# Altium schematic sheet Audio Codec TI WIP.SchDoc: Audio Codec
size Tabloid; ApprovedBy: NA; CompanyName: Cospan Design LLC; DrawnBy: David McCoy; Engineer: David McCoy; DocumentNumber: 13; Revision: A; SheetNumber: 13; SheetTotal: 18; Client: OSH; Project: Guppy Buddy; ProjectPrettyName: Guppy Buddy
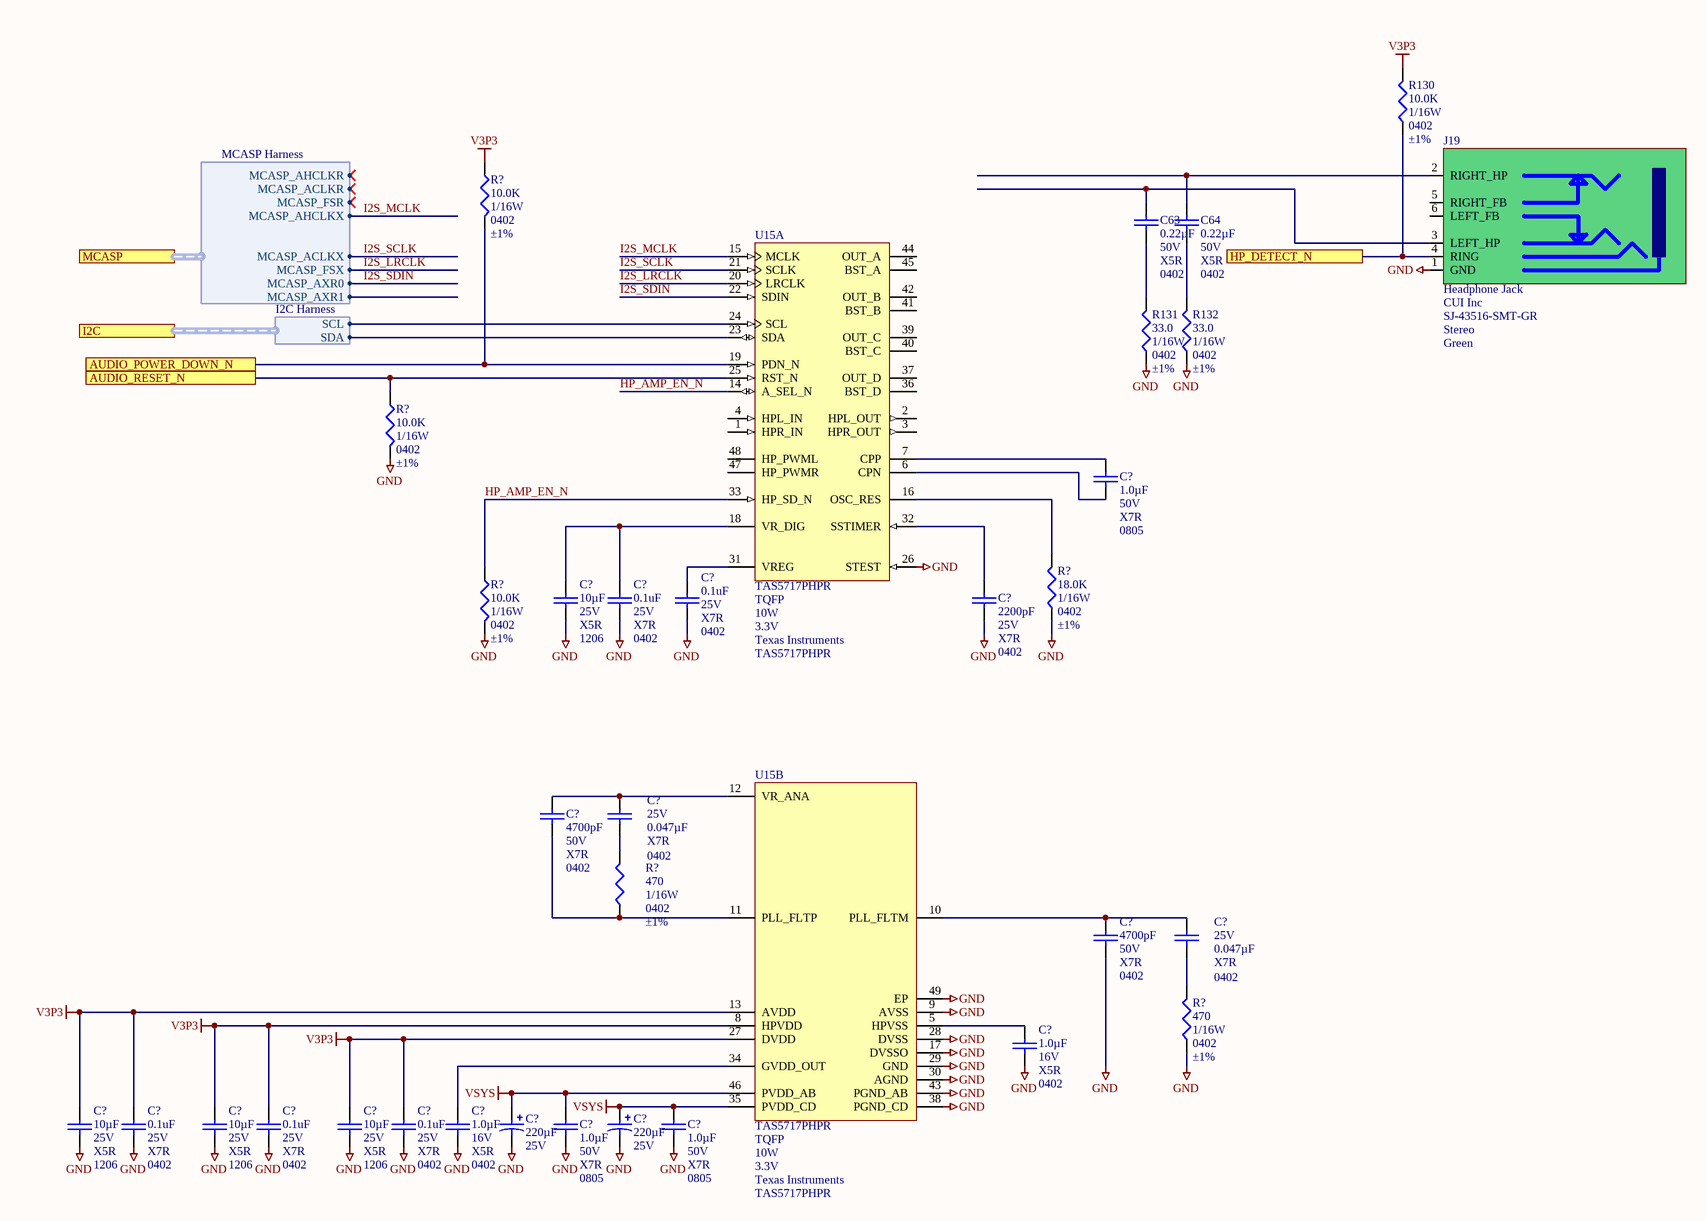
[diagram p0: Audio Codec TI WIP.SchDoc]

## Parts
(Parts that share a designator on the sheet are numbered #1, #2 ... from top to bottom, then left to right.)
C63  Capacitance: 0.22µF  Voltage - Rated: 50V  Temperature Coefficient: X5R  Package / Case: 0402  [C_ERA-0402]  (hidden comment: C_0402_0.22UF_50V)
C64  Capacitance: 0.22µF  Voltage - Rated: 50V  Temperature Coefficient: X5R  Package / Case: 0402  [C_ERA-0402]  (hidden comment: C_0402_0.22UF_50V)
C?#1  Capacitance: 1.0µF  Voltage - Rated: 50V  Temperature Coefficient: X7R  Package / Case: 0805  [C_ERA-0805]  (hidden comment: 1.0uF)
C?#2  Capacitance: 0.1uF  Voltage - Rated: 25V  Temperature Coefficient: X7R  Package / Case: 0402  [C_0402]  (hidden comment: C_0402_0.1UF_25V)
C?#3  Capacitance: 0.1uF  Voltage - Rated: 25V  Temperature Coefficient: X7R  Package / Case: 0402  [C_0402]  (hidden comment: C_0402_0.1UF_25V)
C?#4  Capacitance: 2200pF  Voltage - Rated: 25V  Temperature Coefficient: X7R  Package / Case: 0402  [C_ERA-0402]  (hidden comment: C_0402_2.2NF)
C?#5  Voltage - Rated: 25V  Temperature Coefficient: X5R  Package / Case: 1206  [CAP-1206]  (hidden comment: 10µF)
C?#6  Voltage - Rated: 50V  Temperature Coefficient: X7R  Package / Case: 0402  [C_ERA-0402]  (hidden comment: 4700pF)
C?#7  Voltage - Rated: 25V  Capacitance: 0.047µF  Temperature Coefficient: X7R  Package / Case: 0402  [C_ERA-0402]  (hidden comment: 0.047UF)
C?#8  Voltage - Rated: 50V  Temperature Coefficient: X7R  Package / Case: 0402  [C_ERA-0402]  (hidden comment: 4700pF)
C?#9  Voltage - Rated: 25V  Capacitance: 0.047µF  Temperature Coefficient: X7R  Package / Case: 0402  [C_ERA-0402]  (hidden comment: 0.047UF)
C?#10  Capacitance: 1.0µF  Voltage - Rated: 16V  Temperature Coefficient: X5R  Package / Case: 0402  [C_0402]  (hidden comment: 1.0uF)
C?#11  Capacitance: 0.1uF  Voltage - Rated: 25V  Temperature Coefficient: X7R  Package / Case: 0402  [C_0402]  (hidden comment: C_0402_0.1UF_25V)
C?#12  Capacitance: 0.1uF  Voltage - Rated: 25V  Temperature Coefficient: X7R  Package / Case: 0402  [C_0402]  (hidden comment: C_0402_0.1UF_25V)
C?#13  Capacitance: 0.1uF  Voltage - Rated: 25V  Temperature Coefficient: X7R  Package / Case: 0402  [C_0402]  (hidden comment: C_0402_0.1UF_25V)
C?#14  Voltage - Rated: 25V  [CAP_INDP190170X170L]  (hidden comment: 220µF)
C?#15  Voltage - Rated: 25V  [CAP_INDP190170X170L]  (hidden comment: 220µF)
C?#16  Capacitance: 1.0µF  Voltage - Rated: 16V  Temperature Coefficient: X5R  Package / Case: 0402  [C_0402]  (hidden comment: 1.0uF)
C?#17  Voltage - Rated: 25V  Temperature Coefficient: X5R  Package / Case: 1206  [CAP-1206]  (hidden comment: 10µF)
C?#18  Voltage - Rated: 25V  Temperature Coefficient: X5R  Package / Case: 1206  [CAP-1206]  (hidden comment: 10µF)
C?#19  Voltage - Rated: 25V  Temperature Coefficient: X5R  Package / Case: 1206  [CAP-1206]  (hidden comment: 10µF)
C?#20  Capacitance: 1.0µF  Voltage - Rated: 50V  Temperature Coefficient: X7R  Package / Case: 0805  [C_ERA-0805]  (hidden comment: 1.0uF)
C?#21  Capacitance: 1.0µF  Voltage - Rated: 50V  Temperature Coefficient: X7R  Package / Case: 0805  [C_ERA-0805]  (hidden comment: 1.0uF)
J19  Headphone Jack  Manufacturer: CUI Inc  Manufacturer Part Number: SJ-43516-SMT-GR  Signal Lines: Stereo  Color: Green  [HEADPHONE_JACK]
R130  Resistance In Ohms: 10.0K  Power (Watts): 1/16W  Case: 0402  Tolerance: ±1%  [R_0402]  (hidden comment: R_0402_10.0K)
R131  Resistance In Ohms: 33.0  Power (Watts): 1/16W  Case: 0402  Tolerance: ±1%  [R_0402]  (hidden comment: R_0402_33)
R132  Resistance In Ohms: 33.0  Power (Watts): 1/16W  Case: 0402  Tolerance: ±1%  [R_0402]  (hidden comment: R_0402_33)
R?#1  Resistance In Ohms: 10.0K  Power (Watts): 1/16W  Case: 0402  Tolerance: ±1%  [R_0402]  (hidden comment: R_0402_10.0K)
R?#2  Resistance In Ohms: 10.0K  Power (Watts): 1/16W  Case: 0402  Tolerance: ±1%  [R_0402]  (hidden comment: R_0402_10.0K)
R?#3  Resistance In Ohms: 18.0K  Power (Watts): 1/16W  Case: 0402  Tolerance: ±1%  [R_0402]  (hidden comment: 18.0k Ohms)
R?#4  Resistance In Ohms: 10.0K  Power (Watts): 1/16W  Case: 0402  Tolerance: ±1%  [R_0402]  (hidden comment: R_0402_10.0K)
R?#5  Power (Watts): 1/16W  Case: 0402  Tolerance: ±1%  [R_0402]  (hidden comment: 470)
R?#6  Power (Watts): 1/16W  Case: 0402  Tolerance: ±1%  [R_0402]  (hidden comment: 470)
U15  TAS5717PHPR  Case/Package: TQFP  Output Power: 10W  Operating Supply Voltage: 3.3V  Manufacturer 1: Texas Instruments  [TI-PHP48-4550X3600TP_L]  (parts A,B of 2)

## Ports
AUDIO_POWER_DOWN_N, AUDIO_RESET_N, HP_DETECT_N, I2C (harness I2C Harness), MCASP (harness MCASP Harness)

## Harnesses
I2C Harness: SCL, SDA
MCASP Harness: MCASP_ACLKX, MCASP_FSX, MCASP_AXR0, MCASP_AHCLKR, MCASP_ACLKR, MCASP_FSR, MCASP_AXR1, MCASP_AHCLKX

## Nets
GND: C?#2.1 C?#3.1 C?#4.1 C?#5.1 C?#8.1 C?#10.1 C?#11.1 C?#12.1 C?#13.1 C?#14.2 C?#15.2 C?#16.1 C?#17.1 C?#18.1 C?#19.1 C?#20.1 C?#21.1 J19.1(GND) R131.2 R132.2 R?#2.2 R?#3.2 R?#4.2 R?#6.2 U15.9(AVSS) U15.17(DVSSO) U15.26(STEST) U15.28(DVSS) U15.29(GND) U15.30(AGND) U15.38(PGND_CD) U15.43(PGND_AB) U15.49(EP)
V3P3: C?#11.2 C?#12.2 C?#13.2 C?#17.2 C?#18.2 C?#19.2 R130.1 R?#1.1 U15.8(HPVDD) U15.13(AVDD) U15.27(DVDD)
VSYS: C?#14.1 C?#15.1 C?#20.2 C?#21.2 U15.35(PVDD_CD) U15.46(PVDD_AB)
AUDIO_POWER_DOWN_N: R?#1.2 U15.19(PDN_N) ; port AUDIO_POWER_DOWN_N
AUDIO_RESET_N: R?#2.1 U15.25(RST_N) ; port AUDIO_RESET_N
HP_AMP_EN_N: R?#4.1 U15.14(A_SEL_N) U15.33(HP_SD_N)
HP_DETECT_N: J19.4(RING) R130.2 ; port HP_DETECT_N
I2S_LRCLK: U15.20(LRCLK) ; port MCASP.MCASP_FSX
I2S_MCLK: U15.15(MCLK) ; port MCASP.MCASP_AHCLKX
I2S_SCLK: U15.21(SCLK) ; port MCASP.MCASP_ACLKX
I2S_SDIN: U15.22(SDIN) ; port MCASP.MCASP_AXR0
NetC63_1: C63.1 R131.1
NetC63_2: C63.2 J19.3(LEFT_HP)
NetC64_1: C64.1 R132.1
NetC64_2: C64.2 J19.2(RIGHT_HP)
NetC?#1_1: C?#1.1 U15.6(CPN)
NetC?#1_2: C?#1.2 U15.7(CPP)
NetC?#2_2: C?#2.2 C?#5.2 U15.18(VR_DIG)
NetC?#3_2: C?#3.2 U15.31(VREG)
NetC?#4_2: C?#4.2 U15.32(SSTIMER)
NetC?#6_1: C?#6.1 R?#5.2 U15.11(PLL_FLTP)
NetC?#6_2: C?#6.2 C?#7.2 U15.12(VR_ANA)
NetC?#7_1: C?#7.1 R?#5.1
NetC?#8_2: C?#8.2 C?#9.2 U15.10(PLL_FLTM)
NetC?#9_1: C?#9.1 R?#6.1
NetC?#10_2: C?#10.2 U15.5(HPVSS)
NetC?#16_2: C?#16.2 U15.34(GVDD_OUT)
NetR?#3_1: R?#3.1 U15.16(OSC_RES)
NetU15_23: U15.23(SDA) ; port I2C.SDA
NetU15_24: U15.24(SCL) ; port I2C.SCL

Not connected (* = marked no-connect by the designer): J19 5(RIGHT_FB) 6(LEFT_FB); U15 1(HPR_IN) 2(HPL_OUT) 3(HPR_OUT) 4(HPL_IN) 36(BST_D) 37(OUT_D) 39(OUT_C) 40(BST_C) 41(BST_B) 42(OUT_B) 44(OUT_A) 45(BST_A) 47(HP_PWMR) 48(HP_PWML)

## Notes on the sheet
- Project:
- http://www.cospandesign.com
- Cospan Design
- Document:
- Engineer:
- Title:
- Client:
- Approved By:
- Revision:
- Date:
- Number:
- of

## Library data of the parts
C63 C64 = C_0402_0.22UF_50V: CAP CER 0.22UF 50V X5R 0402; Manufacturer: Taiyo Yuden; Manufacturer Part Number: UMK105BJ224KV-F; Tolerance: ±10%; Supplier 1: Digi-Key; RoHS: RoHS Compliant; Category: Capacitors; Stock 1: 141424; Pricing 1: 1=0.35, 10=0.263, 50=0.1532, 100=0.1225, 250=0.08752, 500=0.0595, 1000=0.04813, 5000=0.03763 (USD); Packaging: Digi-Reel®; Mounting Type: Surface Mount, MLCC; Operating Temperature: -55°C ~ 85°C; Applications: General Purpose; Ratings: -; Size / Dimension: 0.039" L x 0.020" W (1.00mm x 0.50mm); Height - Seated (Max): -; Thickness (Max): 0.022" (0.55mm); Lead Spacing: -; Features: -; Lead Style: -; ComponentLink1URL: http://ds.yuden.co.jp/TYCOMPAS/ut/detail.do?productNo=UMK105BJ224KV-F&fileName=UMK105BJ224KV-F_SS&mode=specSheetDownload; ComponentLink1Description: http://ds.yuden.co.jp/TYCOMPAS/ut/detail.do?productNo=UMK105BJ224KV-F&fileName=UMK105BJ224KV-F_SS&mode=specSheetDownload; Supplier Part Number 1: 587-3500-6-ND
C?#1 C?#20 C?#21 = C_0805_1.0uF_50V: CAP CER 1UF 50V X7R 0805; Manufacturer 1: Samsung; Manufacturer Part Number 1: CL21B105KBFNNNG; Description 1: Cap Ceramic 1uF 50V X7R 10% SMD 0805 125C Embossed T/R; Material: Ceramic; Tolerance: 10%; ComponentLink1URL: http://search.murata.co.jp/Ceramy/image/img/PDF/ENG/GRM21BR71H105KA12.pdf; ComponentLink1Description: http://search.murata.co.jp/Ceramy/image/img/PDF/ENG/GRM21BR71H105KA12.pdf; Supplier 1: Digi-Key; Supplier Part Number 1: 1276-6470-6-ND; Stock 1: 0; Pricing 1: 1=0.13, 10=0.097, 100=0.043, 500=0.03072, 1000=0.02413 (USD); Mount: Surface Mount; Case/Package: 0805; Case Code (Metric): 2012; Case Code (Imperial): 0805; Contact Plating: Nickel,Tin; Min Operating Temperature: -55°C; Max Operating Temperature: 125°C; Packaging: Tape and Reel; Voltage Rating: 50V; Package Quantity: 3000; Dielectric: X7R; Termination: Wraparound; Voltage: 50V; Length: 2mm; Width: 0.049inch; Thickness: 0.053inch; Depth: 1.25mm; ComponentLink2URL: https://datasheet.ciiva.com/16428/cl05b104kq5nnnc-16428872.pdf; ComponentLink2Description: https://datasheet.ciiva.com/16428/cl05b104kq5nnnc-16428872.pdf; ComponentLink3URL: https://datasheet.ciiva.com/26310/mlcc-catalogdownload2013-eng-26310125.pdf; ComponentLink3Description: https://datasheet.ciiva.com/26310/mlcc-catalogdownload2013-eng-26310125.pdf; ComponentLink4URL: https://datasheet.ciiva.com/25733/cl21b105kbfnnng-25733278.pdf; ComponentLink4Description: https://datasheet.ciiva.com/25733/cl21b105kbfnnng-25733278.pdf; ComponentLink5URL: https://datasheet.ciiva.com/29199/455898-da-01-en-vs-kondensator-0805-29199201.pdf; ComponentLink5Description: https://datasheet.ciiva.com/29199/455898-da-01-en-vs-kondensator-0805-29199201.pdf
C?#2 C?#3 C?#11-C?#13 = C_0402_0.1UF_25V: CAP CER 0.1UF 25V X6S 0402; Manufacturer 1: Yageo; Manufacturer Part Number 1: CC0402KRX7R8BB104; Description 1: Cap Ceramic 0.1uF 25V X7R 10% SMD 0402 125C Paper T/R; Tolerance: 10%; Dissipation Factor: 3.5%; ComponentLink1URL: https://product.tdk.com/info/en/catalog/datasheets/mlcc_commercial_general_en.pdf; ComponentLink1Description: https://product.tdk.com/info/en/catalog/datasheets/mlcc_commercial_general_en.pdf; Supplier 1: Digi-Key; Supplier Part Number 1: 311-2077-1-ND; Stock 1: 0; Pricing 1: 1=0.1, 10=0.048, 100=0.0215, 500=0.01534, 1000=0.01205, 2500=0.01095, 5000=0.01007 (USD); Mount: Surface Mount; Case/Package: 0402; Case Code (Imperial): 0402; Case Code (Metric): 1005; Min Operating Temperature: -55°C; Max Operating Temperature: 125°C; Voltage Rating: 25V; Voltage Rating (DC): 25V; Packaging: Tape and Reel; Dielectric: X7R; Termination: SMD/SMT; Composition: Ceramic; Length: 1mm; Height: 0.5mm; Width: 0.02inch; Thickness: 0.022inch; Depth: 0.5mm; Radiation Hardening: No; Lead Free: Lead Free; Halogen Free: Halogen Free; ComponentLink2URL: https://datasheet.ciiva.com/11464/upy-gphc-x7r-6-3v-to-50v-8-11464889.pdf; ComponentLink2Description: https://datasheet.ciiva.com/11464/upy-gphc-x7r-6-3v-to-50v-8-11464889.pdf; ComponentLink3URL: https://datasheet.ciiva.com/13210/upy-gphc-x7r-6-3v-to-50v-8-12304-13210908.pdf; ComponentLink3Description: https://datasheet.ciiva.com/13210/upy-gphc-x7r-6-3v-to-50v-8-12304-13210908.pdf; ComponentLink4URL: https://datasheet.ciiva.com/17437/upy-gphc-x7r-6-3v-to-50v-8-17437357.pdf; ComponentLink4Description: https://datasheet.ciiva.com/17437/upy-gphc-x7r-6-3v-to-50v-8-17437357.pdf
C?#4 = C_0402_2.2NF: CAP CER 2200PF 25V X7R 0201; Manufacturer: TDK Corporation; Manufacturer Part Number: C0603X7R1E222K030BA; Tolerance: ±10%; Supplier 1: Digi-Key; RoHS: RoHS Compliant; Category: Capacitors; Stock 1: 85740; Pricing 1: 1=0.1, 10=0.025, 100=0.0116, 250=0.00944, 500=0.00808, 1000=0.0063, 5000=0.00525 (USD); Packaging: Cut Tape (CT); Mounting Type: Surface Mount, MLCC; Operating Temperature: -55°C ~ 125°C; Applications: General Purpose; Ratings: -; Size / Dimension: 0.024" L x 0.012" W (0.60mm x 0.30mm); Height - Seated (Max): -; Thickness (Max): 0.013" (0.33mm); Lead Spacing: -; Features: -; Lead Style: -; ComponentLink1URL: https://product.tdk.com/info/en/catalog/datasheets/mlcc_commercial_general_en.pdf; ComponentLink1Description: https://product.tdk.com/info/en/catalog/datasheets/mlcc_commercial_general_en.pdf; Supplier Part Number 1: 445-7279-1-ND
C?#5 C?#17-C?#19 = C_1206_10UF_25V: CAP CER 10UF 25V X5R 1206; Manufacturer 1: Samsung; Manufacturer Part Number 1: CL31A106KAHNNNE; Tolerance: 10%; Description 1: Cap Ceramic 10uF 25V X5R 10% SMD 1206 85C T/R; Material: Ceramic; Supplier 1: Digi-Key; Supplier Part Number 1: 1276-1075-6-ND; Stock 1: 0; Height: 1.6mm; Thickness: 0.071inch; Packaging: Tape and Reel; ComponentLink1URL: http://search.murata.co.jp/Ceramy/image/img/PDF/ENG/GRM31CR61E106MA12.pdf; ComponentLink1Description: http://search.murata.co.jp/Ceramy/image/img/PDF/ENG/GRM31CR61E106MA12.pdf; Capacitance: 10µF; Pricing 1: 1=0.28, 10=0.188, 100=0.095, 500=0.065, 1000=0.0575 (USD); Mount: Surface Mount; Case/Package: 1206; Case Code (Metric): 3216; Case Code (Imperial): 1206; Contact Plating: Tin; Min Operating Temperature: -55°C; Max Operating Temperature: 85°C; Dielectric: X5R; Voltage: 25V; Voltage Rating (DC): 25V; Voltage Rating: 25V; Length: 3.2mm; Depth: 1.6mm; Width: 0.063inch; Radiation Hardening: No; Lead Free: Lead Free; ComponentLink2URL: https://datasheet.ciiva.com/25710/cl31a106kahnnne-25710837.pdf; ComponentLink2Description: https://datasheet.ciiva.com/25710/cl31a106kahnnne-25710837.pdf; ComponentLink3URL: https://datasheet.ciiva.com/15195/getdatasheetpartid-355210-15195990.pdf; ComponentLink3Description: https://datasheet.ciiva.com/15195/getdatasheetpartid-355210-15195990.pdf; ComponentLink4URL: https://datasheet.ciiva.com/16740/cl31a106kahnnne-16740633.pdf; ComponentLink4Description: https://datasheet.ciiva.com/16740/cl31a106kahnnne-16740633.pdf; ComponentLink5URL: https://datasheet.ciiva.com/29201/452519-da-01-en-vs-kondensator-1206-29201124.pdf; ComponentLink5Description: https://datasheet.ciiva.com/29201/452519-da-01-en-vs-kondensator-1206-29201124.pdf
C?#6 C?#8 = C_0402_4700pF_50V: CAP CER 4700PF 50V 10% X7R 0402; Manufacturer: Yageo; Manufacturer Part Number: CC0402KRX7R9BB472; Supplier 1: Digi-Key; RoHS: RoHS Compliant; Category: Capacitors; Stock 1: 466253; Pricing 1: 1=0.1, 10=0.015, 25=0.0104, 100=0.0068, 250=0.00552, 500=0.00474, 1000=0.00369, 2500=0.00332, 5000=0.00308 (USD); Packaging: Cut Tape (CT); Tolerance: ±10%; Mounting Type: Surface Mount, MLCC; Operating Temperature: -55°C ~ 125°C; Applications: General Purpose; Ratings: -; Size / Dimension: 0.039" L x 0.020" W (1.00mm x 0.50mm); Height - Seated (Max): -; Thickness (Max): 0.022" (0.55mm); Lead Spacing: -; Features: -; Lead Style: -; ComponentLink1URL: http://www.yageo.com/documents/recent/UPY-GPHC_X7R_6.3V-to-50V-v12.pdf; ComponentLink1Description: http://www.yageo.com/documents/recent/UPY-GPHC_X7R_6.3V-to-50V-v12.pdf; Supplier Part Number 1: 311-1418-1-ND; Capacitance: 4700pF
C?#7 C?#9 = C_0402_0.047UF: CAP CER 47000PF 25V X7R 0402; Manufacturer: TDK Corporation; Manufacturer Part Number: C1005X7R1E473K; Tolerance: ±10%; Supplier 1: Digi-Key; Supplier Part Number 1: 445-4941-1-ND; RoHS: RoHS Compliant; Category: Capacitors; Stock 1: 79481; Pricing: 10=0.03, 100=0.0176, 500=0.01012, 1000=0.00702 (USD); Mounting Type: Surface Mount, MLCC; Operating Temperature: -55°C ~ 125°C; Features: Low ESR; Applications: General Purpose; Ratings: -; Size / Dimension: 0.039" L x 0.020" W (1.00mm x 0.50mm); Thickness: 0.50mm; Lead Spacing: -; Packaging: Cut Tape (CT); Lead Style: -; ComponentLink1URL: http://www.tdk.com/pdf/general_A11.pdf; ComponentLink1Description: http://www.tdk.com/pdf/general_A11.pdf
C?#10 C?#16 = C_0402_1.0UF_16V: CAP CER 1.0UF 16V X5R 0402; Manufacturer 1: Samsung; Manufacturer Part Number 1: CL05A105KO5NNNC; Description 1: Cap Ceramic 1uF 16V X5R 10% SMD 0402 85C Paper T/R; Tolerance: 10%; ComponentLink1URL: http://ds.yuden.co.jp/TYCOMPAS/ut/detail.do?productNo=EMK105BJ105KV-F&fileName=EMK105BJ105KV-F_SS&mode=specSheetDownload; ComponentLink1Description: http://ds.yuden.co.jp/TYCOMPAS/ut/detail.do?productNo=EMK105BJ105KV-F&fileName=EMK105BJ105KV-F_SS&mode=specSheetDownload; ComponentLink2URL: https://datasheet.ciiva.com/16207/cl05a105ko5nnnc-16207571.pdf; ComponentLink2Description: https://datasheet.ciiva.com/16207/cl05a105ko5nnnc-16207571.pdf; ComponentLink3URL: https://datasheet.ciiva.com/15195/getdatasheetpartid-355272-15195629.pdf; ComponentLink3Description: https://datasheet.ciiva.com/15195/getdatasheetpartid-355272-15195629.pdf; Supplier 1: Digi-Key; Supplier Part Number 1: 1276-1067-6-ND; Stock 1: 26908; Pricing 1: 1=0.1, 10=0.062, 100=0.0276, 500=0.01968, 1000=0.01547, 2500=0.01406, 5000=0.01294 (USD); Mount: Surface Mount; Case/Package: 0402; Case Code (Metric): 1005; Case Code (Imperial): 0402; Contact Plating: Tin; Min Operating Temperature: -55°C; Max Operating Temperature: 85°C; Dielectric: X5R; Packaging: Tape and Reel; Package Quantity: 1; Voltage Rating: 16V; Voltage: 16V; Length: 1mm; Height: 0.5mm; Width: 0.02inch; Thickness: 0.022inch; Depth: 0.5mm; Radiation Hardening: No
C?#14 C?#15 = C_ALUM_220UF_25V: CAP ALUM 220UF 20% 25V SMD; Capacitance: 220µF
J19 = J_HEADPHONE_JACK: CONN AUDIO JACK 3.5MM 4COND SMD; Gender: Female; Plug/Mating Plug Diameter: 3.50mm (0.141", 1/8", Mini Plug) - Headphone; Number of Positions/Contacts: 4 Conductors, 6 Contacts; Internal Switch(s): Two Switches; Shielding: Unshielded; Supplier 1: Digi-Key; Supplier Part Number 1: CP-43516SJGRCT-ND; RoHS: RoHS Compliant; Category: Connectors, Interconnects; Stock 1: 3934; Pricing: 1=1.26, 10=0.982, 100=0.749, 500=0.59796 (USD); Connector Type: Phone Jack; Mounting Type: Surface Mount, Right Angle; Termination: Solder; Features: Board Guide; Packaging: Cut Tape (CT); ComponentLink1URL: http://products.cui.com/GetSpecForDigikey.aspx?MFGNum=SJ-43516-SMT; ComponentLink1Description: http://products.cui.com/GetSpecForDigikey.aspx?MFGNum=SJ-43516-SMT
R130 R?#1 R?#2 R?#4 = R_0402_10.0K: RES 10.0K OHM 1/16W 1% 0402 SMD; Manufacturer: Stackpole Electronics Inc; Manufacturer Part Number: RMCF0402FT10K0; Resistance (Ohms): 10k; Temperature Coefficient: ±100ppm/°C; Supplier 1: Digi-Key; Supplier Part Number 1: RMCF0402FT10K0CT-ND; RoHS: RoHS Compliant; Category: Resistors; Stock 1: 234525; Pricing: 1=0.04, 10=0.025, 50=0.0138, 100=0.0105, 250=0.0078, 500=0.00576, 1000=0.00384, 2500=0.00324, 5000=0.0027 (USD); Composition: Thick Film; Features: -; Package / Case: 0402 (1005 Metric); Size / Dimension: 0.039" L x 0.020" W (1.00mm x 0.50mm); Height: 0.016" (0.40mm); Number of Terminations: 2; Packaging: Cut Tape (CT); ComponentLink1URL: http://www.seielect.com/Catalog/SEI-RMCF_RMCP.pdf; ComponentLink1Description: http://www.seielect.com/Catalog/SEI-RMCF_RMCP.pdf
R131 R132 = R_0402_33: RES 33.0 OHM 1/16W 1% 0402 SMD; Manufacturer: Yageo; Manufacturer Part Number: RC0402FR-0733RL; Resistance (Ohms): 33; Temperature Coefficient: ±100ppm/°C; Supplier 1: Digi-Key; Supplier Part Number 1: 311-33.0LRCT-ND; RoHS: RoHS Compliant; Category: Resistors; Stock 1: 733920; Pricing: 10=0.014, 50=0.0104, 100=0.0079, 250=0.00584, 500=0.00432, 1000=0.00288 (USD); Composition: Thick Film; Features: -; Size / Dimension: 0.039" L x 0.020" W (1.00mm x 0.50mm); Height: 0.014" (0.35mm); Number of Terminations: 2; Packaging: Cut Tape (CT); Package / Case: 0402 (1005 Metric); ComponentLink1URL: http://www.yageo.com/documents/recent/PYu-RC0402_51_RoHS_L_6.pdf; ComponentLink1Description: http://www.yageo.com/documents/recent/PYu-RC0402_51_RoHS_L_6.pdf
R?#3 = R_0402_18.0K: RES SMD 18K OHM 1% 1/16W 0402; Manufacturer: Yageo; Manufacturer Part Number: RC0402FR-0718KL; Temperature Coefficient: ±100ppm/°C; Supplier 1: Digi-Key; Supplier Part Number 1: 311-18.0KLRCT-ND; RoHS: RoHS Compliant; Category: Resistors; Stock 1: 2103351; Pricing: 10=0.014, 100=0.0063, 500=0.00382, 1000=0.0027, 5000=0.00203 (USD); Resistance (Ohms): 18K; Composition: Thick Film; Features: -; Package / Case: 0402 (1005 Metric); Size / Dimension: 0.039" L x 0.020" W (1.00mm x 0.50mm); Height: 0.016" (0.40mm); Number of Terminations: 2; Packaging: Cut Tape (CT); ComponentLink1URL: http://www.yageo.com/documents/recent/PYu-RC0402_51_RoHS_L_6.pdf; ComponentLink1Description: http://www.yageo.com/documents/recent/PYu-RC0402_51_RoHS_L_6.pdf
R?#5 R?#6 = R_0402_470: RES 470 OHM 1/16W 1% 0402 SMD; Manufacturer: Vishay Dale; Manufacturer Part Number: CRCW0402470RFKED; Temperature Coefficient: ±100ppm/°C; Supplier 1: Digi-Key; Supplier Part Number 1: 541-470LCT-ND; RoHS: RoHS Compliant; Category: Resistors; Stock 1: 191624; Pricing: 10=0.083, 50=0.0444, 200=0.0255, 1000=0.0174 (USD); Resistance (Ohms): 470; Composition: Thick Film; Features: -; Package / Case: 0402 (1005 Metric); Size / Dimension: 0.039" L x 0.020" W (1.00mm x 0.50mm); Height: 0.016" (0.40mm); Number of Terminations: 2; Packaging: Cut Tape (CT); ComponentLink1URL: http://www.vishay.com/doc?20035; ComponentLink1Description: http://www.vishay.com/doc?20035; Resistance In Ohms: 470
U15 = U_TAS5717PHPR: Digital Input Stereo Amplifier with Integrated CAP Free Headphone Amplifier, 0 to 85 degC, 48-pin QFP (PHP48), Green (RoHS & no Sb/Br); Max. Number of Speaker Outputs: 2; Power Stage Supply Min(V): 4.5; Analog Supply Max [V]: 3.6; Analog Supply Min [V]: 3; SubFamily: Mid/High-Power Amplifier; Description 1: IC AMP AUD DGTL 10W 48HTQFP; Nominal Supply Current: 34mA; Min Supply Voltage (DC): 3V; Load Impedance: 8R; ComponentLink2URL: http://www.ti.com/general/docs/lit/getliterature.tsp?genericPartNumber=TAS5717&fileType=pdf; Mounting Technology: Surface Mount; ComponentLink2Description: Datasheet; ComponentLink3Description: Package Specification; PartNumber: TAS5717PHPR; PackageReference: PHP48-4550X3600TP; ComponentLink3URL: http://www.ti.com/litv/pdf/mpdi001b; PackageDescription: 48-Pin PowerPAD(TM) Plastic Quad Flatpack, Body 7 x 7 mm, Pitch 0.5 mm; Eco-Plan: Green (RoHS & no Sb/Br); Manufacturer: Texas Instruments; DatasheetVersion: SLOS655A; ComponentLink1Description: Manufacturer URL; ComponentLink1URL: http://www.ti.com/; Digital Supply Min [V]: 3; PackageVersion: 4146927/B, 08/2003; Code_JEDEC: MS-026; Input Type: Digital; Stock 1: 1179; Number of Pins: 48; Contact Plating: Gold; Min Operating Temperature: 0°C; Max Operating Temperature: 85°C; Package Quantity: 1; Packaging: Tape and Reel; Number of Channels: 2; Max Supply Current: 34mA; Length: 7.2mm; Height: 1.05mm; Width: 7.2mm; Radiation Hardening: No; REACH SVHC: No SVHC; Lead Free: Lead Free; ComponentLink4URL: http://www.ti.com/lit/ds/symlink/tas5717.pdf; ComponentLink4Description: http://www.ti.com/lit/ds/symlink/tas5717.pdf; ComponentLink5URL: https://www.verical.com/server-webapp/html/getDatasheet?partID=293624; ComponentLink5Description: https://www.verical.com/server-webapp/html/getDatasheet?partID=293624; ComponentLink6URL: http://www.ti.com/general/docs/lit/getliterature.tsp?genericPartNumber=TAS5719&&fileType=pdf; ComponentLink6Description: http://www.ti.com/general/docs/lit/getliterature.tsp?genericPartNumber=TAS5719&&fileType=pdf; ComponentLink7URL: http://datasheet.iiic.cc/texas_instruments/TAS5717PHPR.pdf; ComponentLink7Description: http://datasheet.iiic.cc/texas_instruments/TAS5717PHPR.pdf; Pricing 1: 1=3.96, 10=3.559, 100=2.9163, 500=2.48262 (USD); Supplier 1: Digi-Key; Supplier Part Number 1: 296-28062-1-ND; Max Output Power: 10W; Manufacturer Part Number 1: TAS5717PHPR